# EAGLE design LoRa_Node_1.3 (EAGLE 7.7.0)
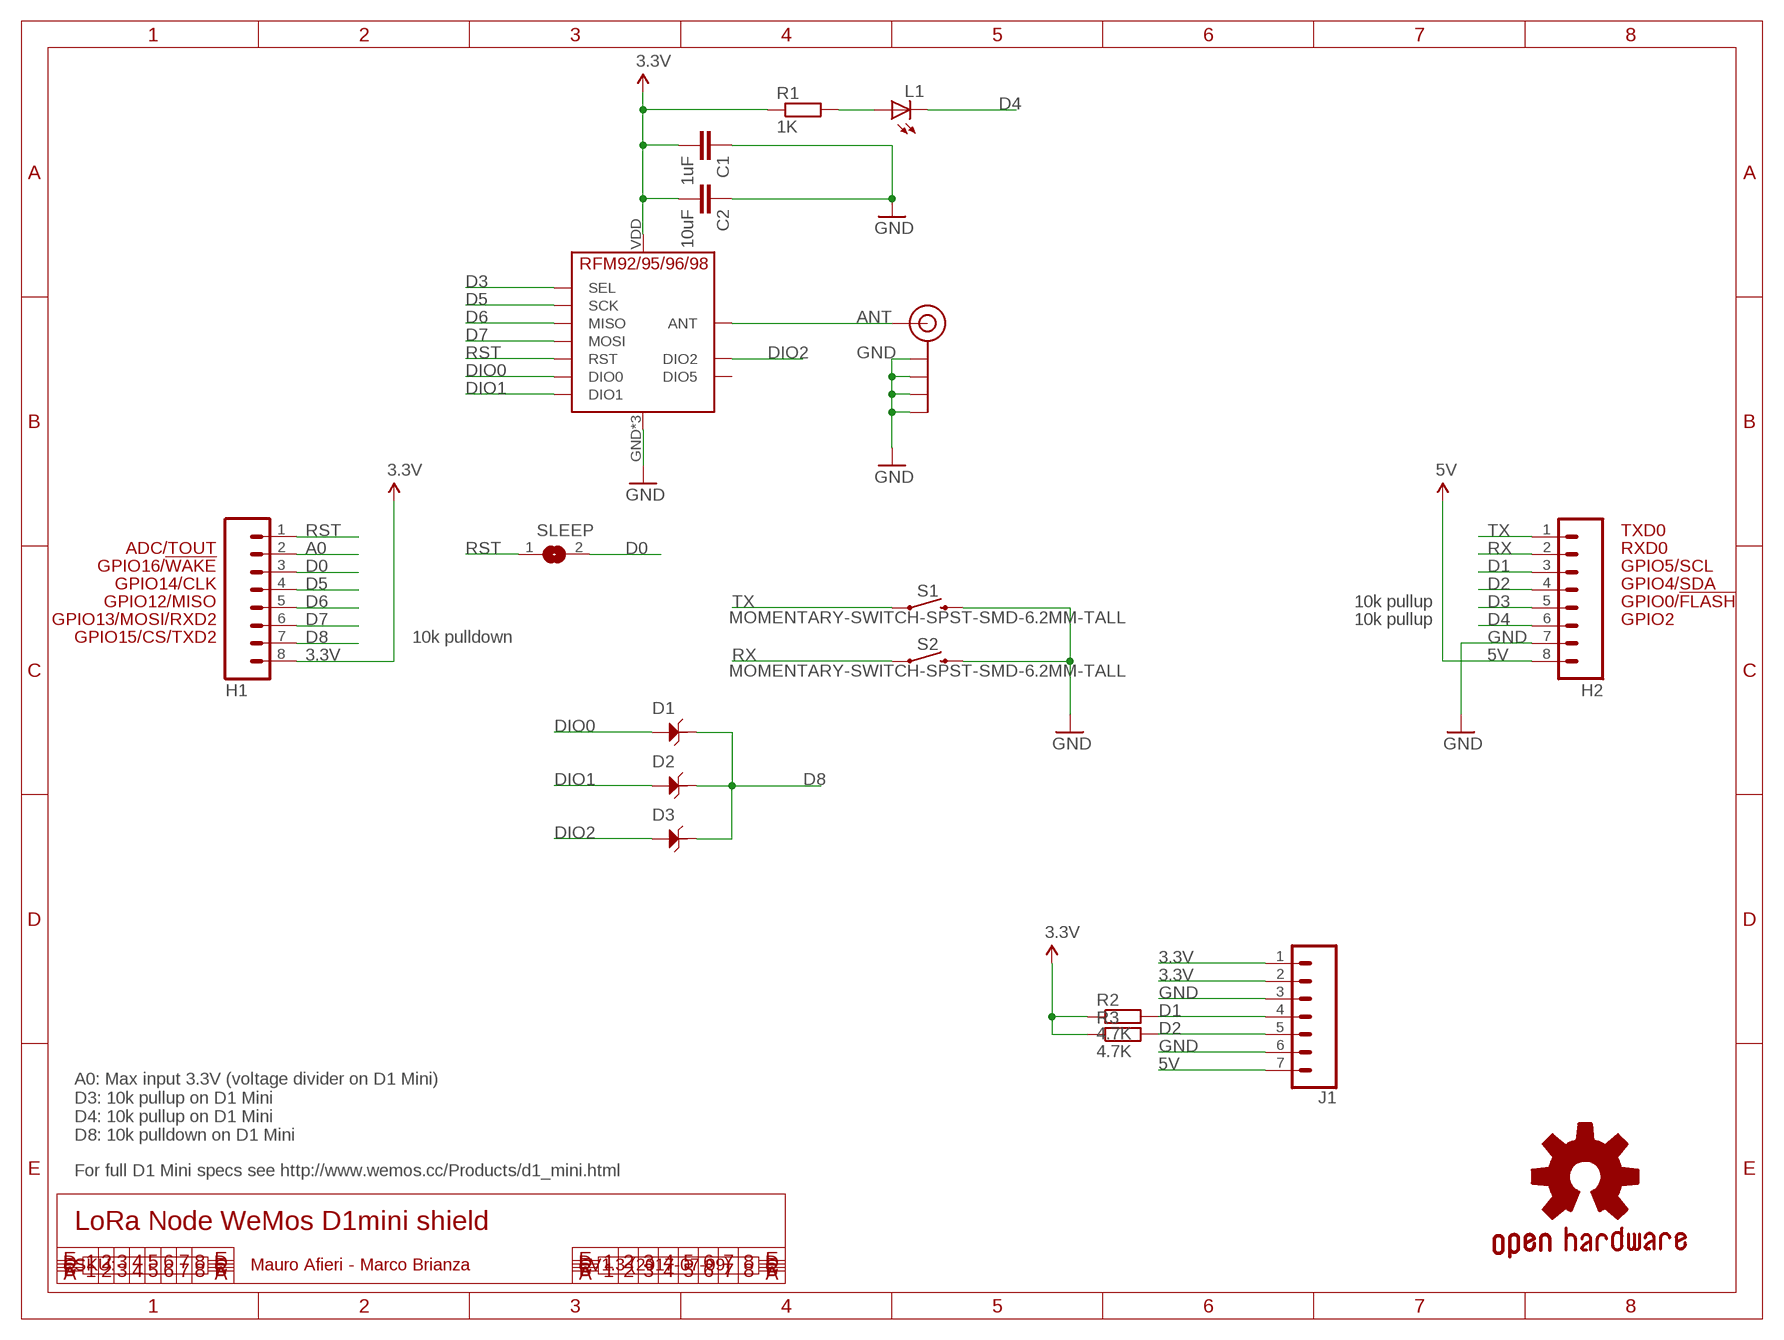
[diagram p0: schematic, sheet 1]

## Parts
C1  1uF  CAP0805-CAP-LARGEPADS  [0805-CAP-LARGEPADS]
C2  10uF  CAP0805-CAP-LARGEPADS  [0805-CAP-LARGEPADS]
D1  D-ESD-2P-CESD5V0D1  [SOD123-2.7X1.6]
D2  D-ESD-2P-CESD5V0D1  [SOD123-2.7X1.6]
D3  D-ESD-2P-CESD5V0D1  [SOD123-2.7X1.6]
GOLD_ORB_SM1  OSHWLOGO_GOLD_ORB_SM  [OSHW2]
H1  M08  [1X08]
H2  M08  [1X08]
J1  CONN_07  [1X07]
J$1  ANTENNATINY  [SMA_UFL_PAD_TINY]
L1  LEDCHIPLED_0805  [CHIPLED_0805]
R1  1K  R-EU_M0805  [M0805]
R2  4.7K  R-EU_M0805  [M0805]
R3  4.7K  R-EU_M0805  [M0805]
S1  MOMENTARY-SWITCH-SPST-SMD-6.2MM-TALL  [TACTILE_SWITCH_SMD_6.2MM_TALL]
S2  MOMENTARY-SWITCH-SPST-SMD-6.2MM-TALL  [TACTILE_SWITCH_SMD_6.2MM_TALL]
SLEEP  SJ  [SJ]
U$2  RFM95  [RFM95]

## Nets
3.3V: C1.2 C2.2 H1.8 J1.1 J1.2 R1.1 R2.1 R3.1 U$2.VDD(VCC)
5V: H2.8 J1.7
A0: H1.2
ANT: J$1.ANT1(SIGNAL) J$1.ANT2(SIGNAL) J$1.ANT3(SIGNAL) U$2.ANT
D0: H1.3 SLEEP.2
D1: H2.3 J1.4 R2.2
D2: H2.4 J1.5 R3.2
D3: H2.5 U$2.NSS(SEL)
D4: H2.6 L1.C
D5: H1.4 U$2.SCK
D6: H1.5 U$2.MISO
D7: H1.6 U$2.MOSI
D8: D1.2 D2.2 D3.2 H1.7
DIO0: D1.1 U$2.DIO0
DIO1: D2.1 U$2.DIO1
DIO2: D3.1 U$2.DIO2
GND: C1.1 C2.1 H2.7 J1.3 J1.6 J$1.GND1(GND) J$1.GND2(GND) J$1.GND3(GND) J$1.GND4(GND) S1.B2 S2.B2 U$2.GND U$2.GND1(GND) U$2.GND2(GND)
N$8: L1.A R1.2
RST: H1.1 SLEEP.1 U$2.RST
RX: H2.2 S2.A2
TX: H2.1 S1.A2
Unconnected: U$2.DIO5

## Notes on the sheet
- TXD0
- ADC/TOUT | RXD0
- GPIO16/!WAKE | GPIO5/SCL
- GPIO14/CLK | GPIO4/SDA
- GPIO12/MISO | 10k pullup | GPIO0/!FLASH
- GPIO13/MOSI/RXD2 | 10k pullup | GPIO2
- GPIO15/CS/TXD2 | 10k pulldown
- A0: Max input 3.3V (voltage divider on D1 Mini)
  D3: 10k pullup on D1 Mini
  D4: 10k pullup on D1 Mini
  D8: 10k pulldown on D1 Mini
- For full D1 Mini specs see http://www.wemos.cc/Products/d1_mini.html
- LoRa Node WeMos D1mini shield
- SKU: | Mauro Afieri - Marco Brianza | V1.3 (2017-07-09)

## Library data of the parts
C1 C2 = Lora_c2h:CAP: Capacitor Standard 0603 ceramic capacitor, and 0.1" leaded capacitor.
D1-D3 = Seeed-Discrete:D-ESD-2P: Diodes for Protectiong against ESD
GOLD_ORB_SM1 = bfl:OSHWLOGO: These are Open-Source Hardware logos.
H1 H2 = freetronics-original:M08: Header 8 Standard 8-pin 0.1" header. Use with straight break away headers (SKU : PRT-00116), right angle break away headers (PRT-00553), swiss pins (PRT-00743), machine pins (PRT-00117), and female headers (PRT-00115).
J1 = SparkFun-Connectors:CONN_07: Multi connection point. Often used as Generic Header-pin footprint for 0.1 inch spaced/style header connections On any of the 0.1 inch spaced packages, you can populate with these: Break Away Headers - Straight <https://www.sparkfun.com/products/116> (PRT-00116) Break Away Male Headers - Right Angle <https://www.sparkfun.com/products/553> (PRT-00553) Female Headers <https://www.sparkfun.com/products/115> (PRT-00115) Break Away Headers - Machine Pin <https://www.sparkfun.com/products/117> (PRT-00117) Break Away Female Headers - Swiss Machine Pin <https://www.sparkfun.com/products/743> (PRT-00743) For SCREWTERMINALS and SPRING TERMINALS visit here: Screw Terimnals on SparkFun.com <https://www.sparkfun.com/search/results?term=Screw+Terminals> (5mm/3.5mm/2.54mm spacing) This device is also useful as a general connection point to wire up your design to another part of your project. Our various solder wires solder well into these plated through hole pads. Hook-Up Wire - Assortment (Stranded, 22 AWG) <https://www.sparkfun.com/products/11375> (PRT-11375) Hook-Up Wire - Assortment (Solid Core, 22 AWG) <https://www.sparkfun.com/products/11367> (PRT-11367) View the entire wire category on our website here <https://www.sparkfun.com/categories/141> Special notes: Molex polarized connector foot print use with SKU : PRT-08231 with associated crimp pins and housings. 1MM SMD Version SKU: PRT-10208 NOTES ON THE VARIANTS LOCK and LOCK_LONGPADS... This footprint was designed to help hold the alignment of a through-hole component (i.e. 6-pin header) while soldering it into place. You may notice that each hole has been shifted either up or down by 0.005 of an inch from it's more standard position (which is a perfectly straight line). This slight alteration caused the pins (the squares in the middle) to touch the edges of the holes. Because they are alternating, it causes a "brace" to hold the component in place. 0.005 has proven to be the perfect amount of "off-center" position when using our standard breakaway headers. Although looks a little odd when you look at the bare footprint, once you have a header in there, the alteration is very hard to notice. Also,if you push a header all the way into place, it is covered up entirely on the bottom side.
J$1 = Lora_c2h:ANTENNA: SMA Antenna Connector End launch SMA connector. The paste layer has been removed so that the connector can be hand soldered onto the board after reflow.
L1 = led:LED: LED OSRAM: - CHIPLED LG R971, LG N971, LY N971, LG Q971, LY Q971, LO R971, LY R971 LH N974, LH R974 LS Q976, LO Q976, LY Q976 LO Q996 - Hyper CHIPLED LW Q18S LB Q993, LB Q99A, LB R99A - SideLED LS A670, LO A670, LY A670, LG A670, LP A670 LB A673, LV A673, LT A673, LW A673 LH A674 LY A675 LS A676, LA A676, LO A676, LY A676, LW A676 LS A679, LY A679, LG A679 - Hyper Micro SIDELED® LS Y876, LA Y876, LO Y876, LY Y876 LT Y87S - SmartLED LW L88C, LW L88S LB L89C, LB L89S, LG L890 LS L89K, LO L89K, LY L89K LS L896, LA L896, LO L896, LY L896 - TOPLED LS T670, LO T670, LY T670, LG T670, LP T670 LSG T670, LSP T670, LSY T670, LOP T670, LYG T670 LG T671, LOG T671, LSG T671 LB T673, LV T673, LT T673, LW T673 LH T674 LS T676, LA T676, LO T676, LY T676, LB T676, LH T676, LSB T676, LW T676 LB T67C, LV T67C, LT T67C, LS T67K, LO T67K, LY T67K, LW E67C LS E67B, LA E67B, LO E67B, LY E67B, LB E67C, LV E67C, LT E67C LW T67C LS T679, LY T679, LG T679 LS T770, LO T770, LY T770, LG T770, LP T770 LB T773, LV T773, LT T773, LW T773 LH T774 LS E675, LA E675, LY E675, LS T675 LS T776, LA T776, LO T776, LY T776, LB T776 LHGB T686 LT T68C, LB T68C - Hyper Mini TOPLED® LB M676 - Mini TOPLED Santana® LG M470 LS M47K, LO M47K, LY M47K Source: http://www.osram.convergy.de LUXEON: - LUMILED® LXK2-PW12-R00, LXK2-PW12-S00, LXK2-PW14-U00, LXK2-PW14-V00 LXK2-PM12-R00, LXK2-PM12-S00, LXK2-PM14-U00 LXK2-PE12-Q00, LXK2-PE12-R00, LXK2-PE12-S00, LXK2-PE14-T00, LXK2-PE14-U00 LXK2-PB12-K00, LXK2-PB12-L00, LXK2-PB12-M00, LXK2-PB14-N00, LXK2-PB14-P00, LXK2-PB14-Q00 LXK2-PR12-L00, LXK2-PR12-M00, LXK2-PR14-Q00, LXK2-PR14-R00 LXK2-PD12-Q00, LXK2-PD12-R00, LXK2-PD12-S00 LXK2-PH12-R00, LXK2-PH12-S00 LXK2-PL12-P00, LXK2-PL12-Q00, LXK2-PL12-R00 Source: www.luxeon.com KINGBRIGHT: KA-3528ASYC Source: www.kingbright.com
R1-R3 = rcl:R-EU_: RESISTOR, European symbol
S1 S2 = SparkFun-Switches:MOMENTARY-SWITCH-SPST: Momentary Switch (Pushbutton) - SPST Normally-open (NO) SPST momentary switches (buttons, pushbuttons). Variants PTH-12MM - 12mm square, through-hole Momentary Pushbutton Switch - 12mm Square <https://www.sparkfun.com/products/9190> (COM-09190) PTH-6.0MM, PTH-6.0MM-KIT - 6.0mm square, through-hole Mini Pushbutton Switch <https://www.sparkfun.com/products/97> (COM-00097) KIT package intended for soldering kit's - only one side of pads' copper is exposed. PTH-RIGHT-ANGLE-KIT - Right-angle, through-hole Right Angle Tactile Button <https://www.sparkfun.com/products/10791> - Used on SparkFun BigTime Watch Kit <https://www.sparkfun.com/products/11734> SMD-12MM - 12mm square, surface-mount Tactile Button - SMD (12mm) <https://www.sparkfun.com/products/12993> (COM-12993) Used on SparkFun PicoBoard <https://www.sparkfun.com/products/11888> SMD-4.5MM - 4.5mm Square Trackball Switch Used on SparkFun Blackberry Trackballer Breakout <https://www.sparkfun.com/products/13169> SMD-4.6MMX2.8MM - 4.60mm x 2.80mm, surface mount Used on SparkFun SAMD21 Mini Breakout <https://www.sparkfun.com/products/13664> SMD-5.2MM, SMD-5.2-REDUNDANT - 5.2mm square, surface-mount Mini Pushbutton Switch - SMD <https://www.sparkfun.com/products/8720> (COM-08720) Used on Arduino Pro Mini <https://www.sparkfun.com/products/11114> REDUNDANT package connects both switch circuits together SMD-6.0X3.5MM - 6.0 x 3.5mm, surface mount Momentary Reset Switch SMD <https://www.sparkfun.com/products/8229> (COM-08229) SMD-6.2MM-TALL - 6.2mm square, surface mount Tactile Button - SMD (6mm) <https://www.sparkfun.com/products/12992> Used on SparkFun Digital Sandbox <https://www.sparkfun.com/products/12651> SMD-RIGHT-ANGLE - Right-angle, surface mount Used on SparkFun Block for Intel® Edison - Arduino <https://www.sparkfun.com/products/13036>; PROD_ID: SWCH-11966; SF_SKU: COM-12992
SLEEP = jumper:SJ: SMD solder JUMPER
U$2 = Lora_c2h:RFM95

## Net classes
0 default: width 0.203 mm, drill 0.356 mm, clearance 0.152 mm
1 power: width 0.203 mm, clearance 0.152 mm

## Board
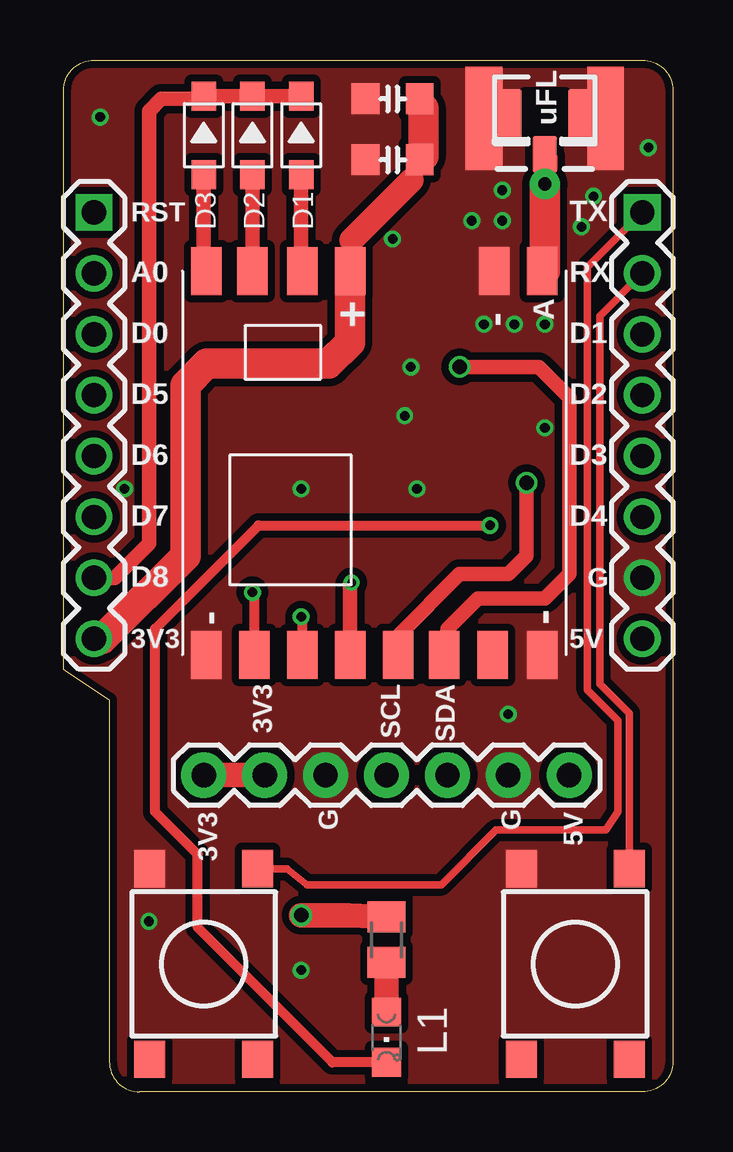
[diagram p1: board, top side]
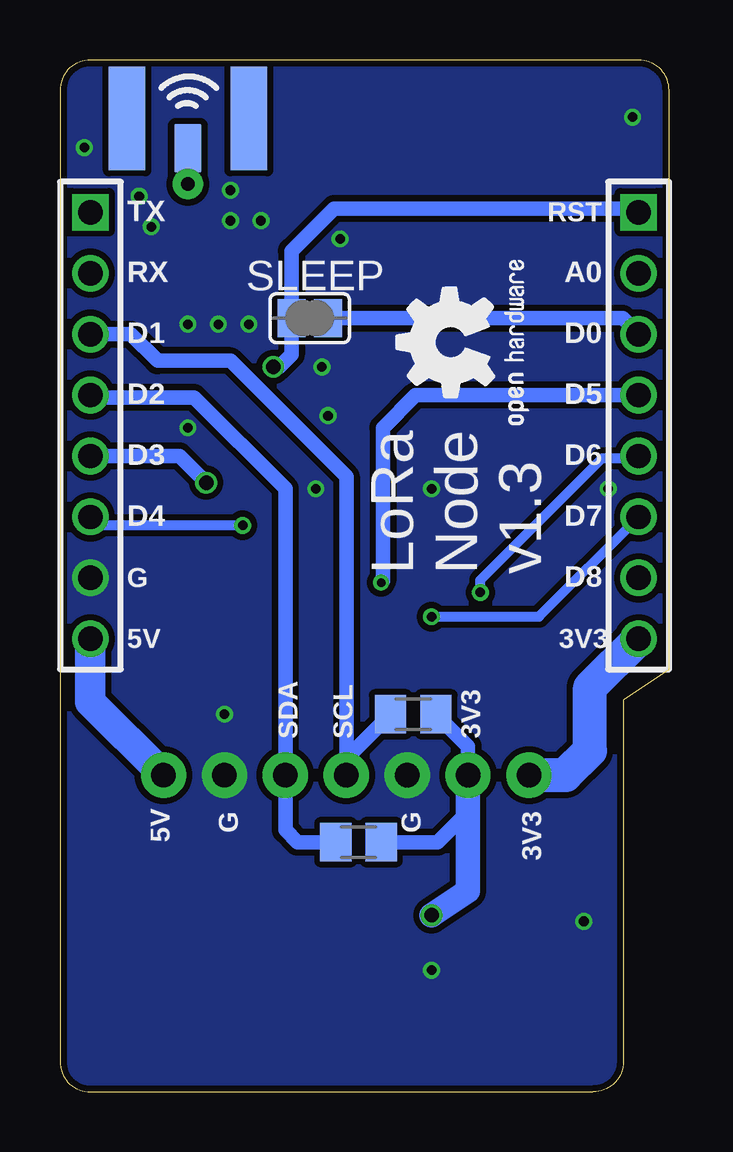
[diagram p2: board, bottom side, seen from below]

Size 25.4 x 43.02 mm. Coordinates in mm from the lower left corner, seen from the top.
Outline: 25.4,41.75 25.4,1.27 arc-90 24.13,0 3.17,0 arc-90 1.91,1.27 1.91,16.35 0,17.62 0,41.75 arc-90 1.27,43.02 24.13,43.02 arc-90 25.4,41.75
Copper layers (1*16): Top 0.035mm / dielectric 1.5mm / Bottom 0.035mm
Design rules "SeeedStudio_2layer_DRU_no_angle_20140221": minimum track width 6mil, minimum drill 12mil, track to track 6mil, track to pad 6mil, pad to pad 6mil, via to via 6mil, smd to smd 0mil, copper to edge 10mil, drill to drill 10mil, minimum pad ring 10mil, minimum via ring 6mil, stop-mask expansion 2mil, vias tented up to drill 100mil, thermal gap 10mil

### Footprints (pad centres in the part's own frame; a part is rotated, then mirrored left to right if it is on the bottom)
0805-CAP-LARGEPADS = smd 1.156 x 1.3: 1 -1.127,0; 2 1.127,0
SOD123-2.7X1.6 = smd 1.2 x 1.02: 1 -1.635,0; 2 1.635,0
1X08 = drill 1.016 square: 1 0,0 | drill 1.016: 2 2.54,0; 3 5.08,0; 4 7.62,0; 5 10.16,0; 6 12.7,0; 7 15.24,0; 8 17.78,0
1X07 = drill 1.016 pad 1.88: 1 0,0; 2 2.54,0; 3 5.08,0; 4 7.62,0; 5 10.16,0; 6 12.7,0; 7 15.24,0
SMA_UFL_PAD_TINY = smd 1.524 x 1.016: ANT1 -3.843,0 | drill 0.559 pad 1.27: ANT2 -5.08,0 | smd 2.032 x 1.143 bottom: ANT3 -3.589,0 | smd 2.2 x 1.016: GND1 -2.223,1.47; GND2 -2.223,-1.47 | smd 4.318 x 1.524: GND3 -2.349,-2.54; GND4 -2.349,2.54 | smd 4.318 x 1.524 bottom: GND5 -2.349,2.54; GND6 -2.349,-2.54
CHIPLED_0805 = smd 1.2 x 1.2: A 0,-1.05; C 0,1.05
M0805 = smd 1.3 x 1.6: 1 -0.95,0; 2 0.95,0
TACTILE_SWITCH_SMD_6.2MM_TALL = smd 1.55 x 1.3: A1 -3.975,-2.25; A2 3.975,-2.25; B1 -3.975,2.25; B2 3.975,2.25
SJ = smd 1.168 x 1.6: 1 -0.762,0; 2 0.762,0
RFM95 = smd 2 x 1.27: ANT 5.777,-7; DIO0 5.777,3; DIO1 5.779,5.095; DIO2 5.779,7; DIO5 -10.225,-4.936; GND 5.777,-5; GND1 -10.223,7; GND2 -10.23,-7; MISO -10.23,5; MOSI -10.225,3; NSS -10.223,-1; RST -10.223,-2.905; SCK -10.23,1.012; VDD 5.777,1

### Placement (x,y rotation side)
C1  13.72,41.4 0 top
C2  13.72,38.86 0 top
D1  9.91,39.88 90 top
D2  7.87,39.88 90 top
D3  5.84,39.88 90 top
GOLD_ORB_SM1  4.83,27.43 90 bottom
H1  1.27,36.67 270 top
H2  24.13,36.67 270 top
J1  5.84,13.21 0 top
J$1  20.07,42.93 90 top
L1  13.46,2.29 180 top
R1  13.46,6.35 270 top
R2  10.67,15.75 180 bottom
R3  12.95,10.41 180 bottom
S1  5.84,5.33 90 top
S2  21.34,5.33 90 top
SLEEP  14.99,32.26 0 bottom
U$2  12.95,28.45 90 top

### Tracks (layer width: path | path; a pad name or v marks a point on that pad's centre or on a via)
3.3V  (via drill 0.6)
  Top 0.203: 15,39 C2.2 14.5,38.5 14.5,38 | 15,41 C1.2 | 12,35.5 U$2.VDD
  Top 1.016: 14.5,38 12,35.5 | J1.2 J1.1 | R1.1 11.87,7.37 v9.91,7.37
  Top 1.27: 15,41 15,39 | H1.8 1.62,18.89 5.08,22.35 5.08,29.46 5.97,30.36 11.05,30.36 11.94,31.24 11.94,34.21 U$2.VDD
  Bottom 0.61: R2.1 8.38,14.41 J1.2 8.38,11.68 9.65,10.41 R3.1
  Bottom 1.016: v9.91,7.37 8.38,8.38 J1.2
  Bottom 1.422: J1.1 4.32,13.21 3.3,14.22 3.3,16.86 H1.8
5V
  Bottom 1.27: H2.8 24.13,16.26 J1.7
ANT
  Top 0.203: J$1.ANT1 20.5,39 20.5,38.5 J$1.ANT2
  Top 1.016: U$2.ANT 20.07,34.23
  Top 1.27: 20.07,34.23 J$1.ANT2
  Bottom 0.203: J$1.ANT3 20,39.5 20,38.5 J$1.ANT2
D0
  Bottom 0.61: SLEEP.2 1.94,32.26 H1.3
D1
  Bottom 0.61: H2.3 22.45,31.59 21.34,30.48 18.29,30.48 13.46,25.65 J1.4 13.46,13.9 R2.2
D2
  Bottom 0.203: H2.4 24,29
  Bottom 0.61: H2.4 24.04,28.96 19.81,28.96 16,25.15 J1.5 16,10.92 15.49,10.41 R3.2
D3  (via drill 0.6)
  Top 0.61: 13.97,18.24 U$2.NSS 13.95,19.03 16.51,21.59 18.54,21.59 19.3,22.35 v19.3,25.4
  Bottom 0.61: v19.3,25.4 20.41,26.51 H2.5
D4  (via drill 0.4)
  Top 0.406: L1.C 11.21,1.24 5.59,6.86 5.59,9.91 3.81,11.68 3.81,19.3 8.13,23.62 v17.78,23.62
  Bottom 0.406: v17.78,23.62 23.78,23.62 H2.6
D5  (via drill 0.36)
  Top 0.61: U$2.SCK 11.94,21.17 v12.01,21.24
  Bottom 0.203: 1,29 H1.4
  Bottom 0.61: H1.4 10.57,29.05 11.94,27.69 11.94,21.31 v12.01,21.24
D6  (via drill 0.4)
  Top 0.406: U$2.MISO 7.95,20.75 v7.87,20.83
  Bottom 0.406: v7.87,20.83 7.87,21.34 2.79,26.42 1.36,26.42 H1.5
D7  (via drill 0.4)
  Top 0.406: U$2.MOSI 9.95,19.76 v9.91,19.81
  Bottom 0.305: H1.6 1.36,23.88
  Bottom 0.406: v9.91,19.81 5.43,19.81 H1.6
D8
  Top 0.61: H1.7 2.13,21.43 3.56,22.86 3.56,40.89 4.06,41.4 5.73,41.4 D3.2 D2.2 D1.2
DIO0
  Top 0.61: U$2.DIO0 9.91,34.27 D1.1
DIO1
  Top 0.61: U$2.DIO1 7.87,34.24 D2.1
DIO2
  Top 0.61: U$2.DIO2 5.84,34.34 D3.1
GND  (via drill 0.4 pad 0.61, 0.4 pad 0.7)
  other vias: 18.29,37.59 18.29,36.32 17.02,36.32 21.59,36.07 22.1,37.34 1.52,40.64 14.48,30.23 14.22,28.19 9.91,25.15 13.72,35.56 20.07,27.69 17.53,32 18.8,32 20.07,32 9.91,5.08 3.56,7.11 14.73,25.15 2.54,25.15 18.54,15.75 24.38,39.37
  pour Top (isolate 0.305, no thermals): 25.4,41.75 arc90 24.13,43.02 1.27,43.02 arc90 0,41.75 0,17.62 1.91,16.35 1.91,1.27 arc90 3.17,0 24.13,0 arc90 25.4,1.27
  pour Bottom (isolate 0.254, no thermals): 25.4,1.27 25.4,41.75 arc90 24.13,43.02 1.27,43.02 arc90 0,41.75 0,17.62 1.91,16.35 1.91,1.27 arc90 3.17,0 24.13,0 arc90
N$8
  Top 1.016: R1.2 L1.A
RST  (via drill 0.6)
  Top 0.61: 15.75,18.34 U$2.RST 16,18.37 16,19.3 17.27,20.57 20.07,20.57 21.08,21.59 21.08,28.96 19.81,30.23 v16.51,30.23
  Bottom 0.61: H1.1 1.43,36.83 13.97,36.83 15.75,35.05 SLEEP.1 15.75,30.73 16.26,30.23 v16.51,30.23
RX
  Top 0.305: S2.A2 23.59,15.78 22.35,17.02 22.35,32.35 H2.2
TX
  Top 0.305: S1.A2 9.31,9.31 10.16,8.64 15.75,8.64 18.03,10.92 22.61,10.92 23.11,11.68 23.11,15.49 21.84,16.76 21.84,34.38 H2.1

### Text on the board
tNames: RST | TX | A0 | RX | D0 | D1 | D5 | D2 | D6 | D3 | D7 | D4 | D8 | G | 3V3 | 5V | 3V3 | SCL | SDA | 3V3 | 5V | G | G
bNames: RST | TX | A0 | RX | D0 | D1 | D5 | D2 | D6 | D3 | D7 | D4 | LoRa / Node / v1.3 | D8 | G | 3V3 | 5V | 3V3 | SCL | SDA | G | G | 3V3 | 5V